# EAGLE design VCAPC_panel (EAGLE 6.5.0)
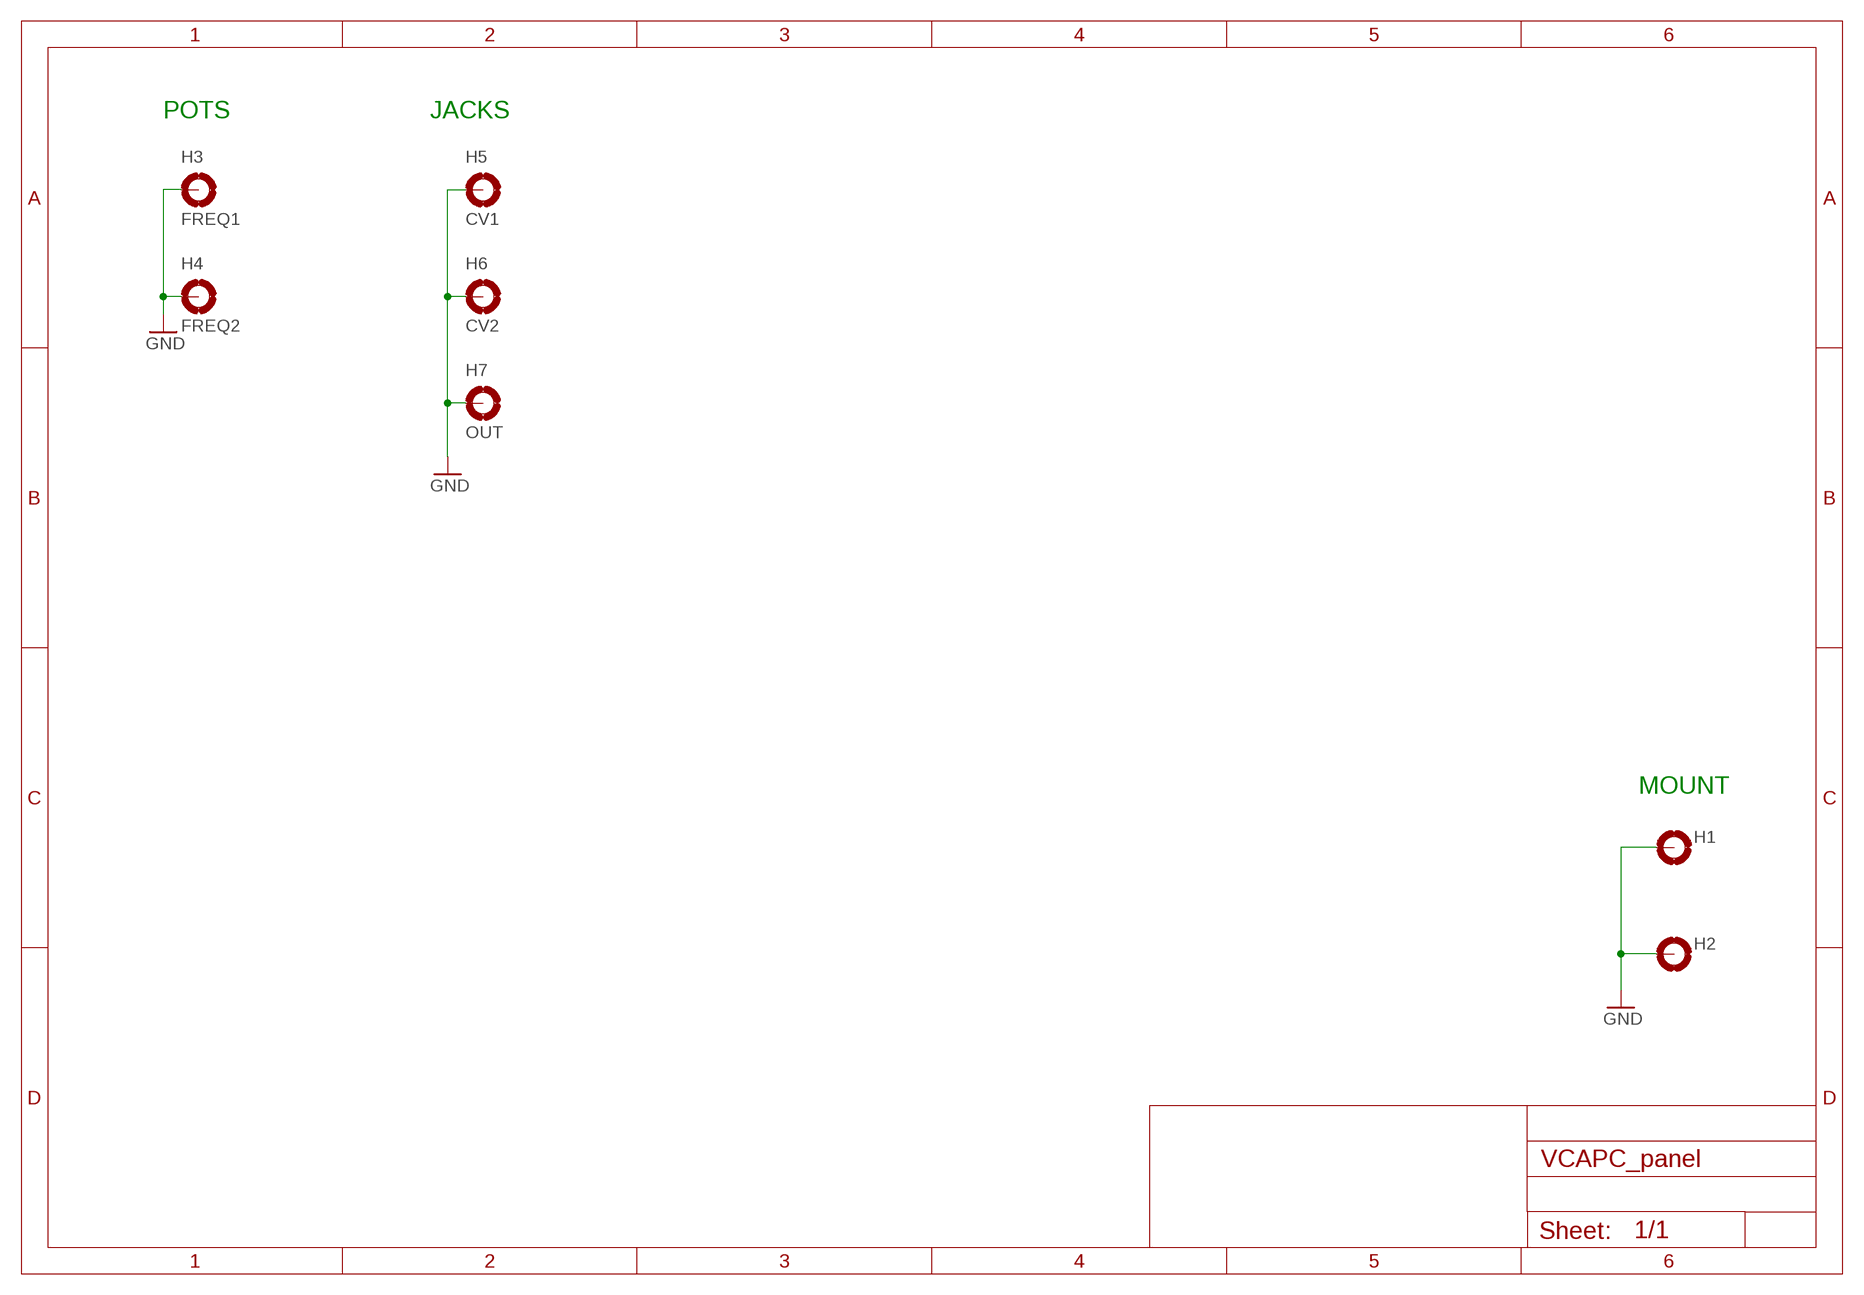
[diagram p0: schematic, sheet 1]

## Parts
H1  MOUNT-PAD-LONG3.2  [3,2-PAD_L]
H2  MOUNT-PAD-LONG3.2  [3,2-PAD_L]
H3  FREQ1  MOUNT-PAD-ROUNDPOT1  [POT_WITH_SCALE]
H4  FREQ2  MOUNT-PAD-ROUNDPOT1  [POT_WITH_SCALE]
H5  CV1  MOUNT-PAD-ROUNDJACK  [PAD_JACK]
H6  CV2  MOUNT-PAD-ROUNDJACK  [PAD_JACK]
H7  OUT  MOUNT-PAD-ROUNDJACK  [PAD_JACK]

## Nets
GND: H1.B3,2(MOUNT) H2.B3,2(MOUNT) H3.1(MOUNT) H4.1(MOUNT) H5.B6,223(MOUNT) H6.B6,223(MOUNT) H7.B6,223(MOUNT)

## Notes on the sheet
- POTS | JACKS
- MOUNT

## Library data of the parts
H1 H2 = _motovilo_holes:MOUNT-PAD-LONG: MOUNT PAD, long
H3-H7 = _motovilo_holes:MOUNT-PAD-ROUND: MOUNT PAD, round

## Board
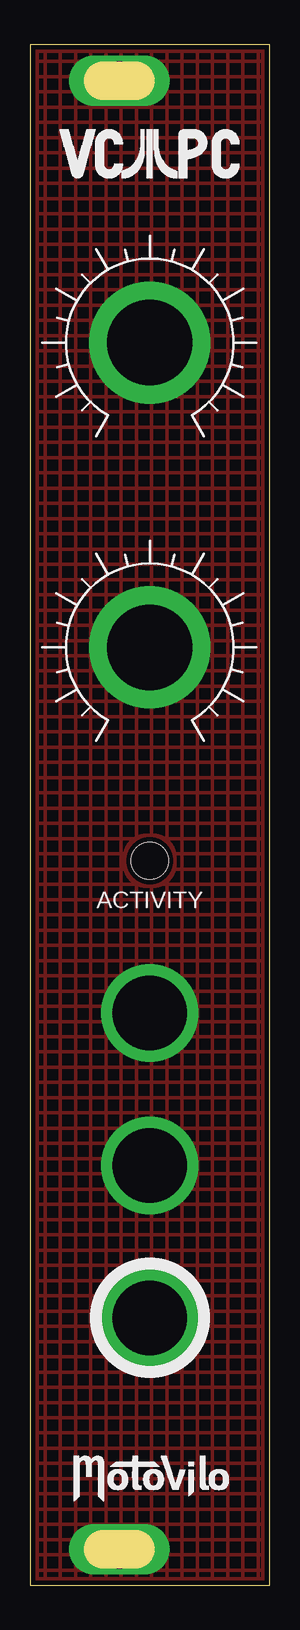
[diagram p1: board, top side]
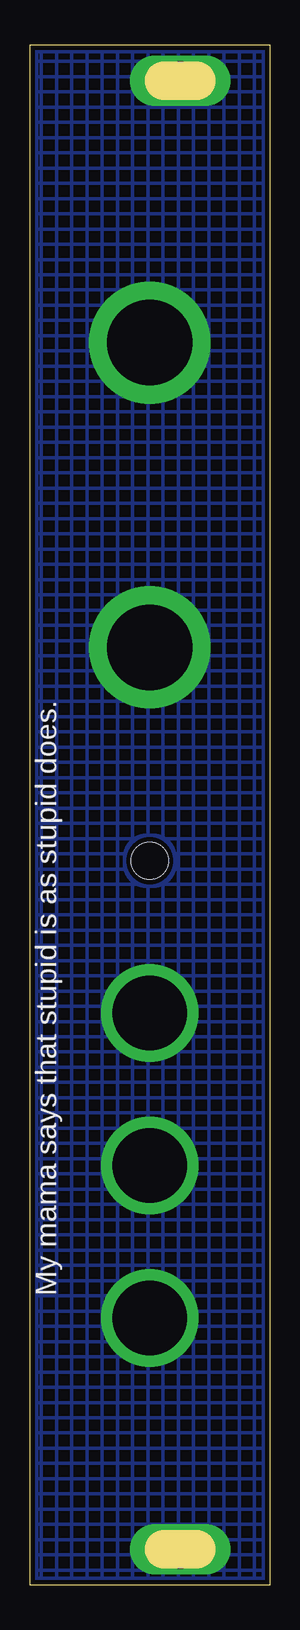
[diagram p2: board, bottom side, seen from below]

Size 20 x 128.4 mm. Coordinates in mm from the lower left corner, seen from the top.
Outline: 0,0 20,0 20,128.4 0,128.4 0,0
Copper layers (1*16): Top 0.035mm / dielectric 1.5mm / Bottom 0.035mm
Design rules "Motovilo Design Rules #2 (8mil)": minimum track width 10mil, minimum drill 12mil, track to track 8mil, track to pad 8mil, pad to pad 8mil, via to via 8mil, smd to smd 0mil, copper to edge 16mil, drill to drill 25mil, minimum pad ring 10mil, minimum via ring 6mil, stop-mask expansion 2mil, vias tented up to drill 100mil, thermal gap 10mil
Holes 3.1 mm at 10,60.39

### Footprints (pad centres in the part's own frame; a part is rotated, then mirrored left to right if it is on the bottom)
3,2-PAD_L = drill 3.2 pad 3.81 long: B3,2 0,0
POT_WITH_SCALE = drill 7.112 pad 10.16: 1 0,0
PAD_JACK = drill 6.223 pad 8.128: B6,223 0,0

### Placement (x,y rotation side)
H1  7.45,3 0 top
H2  7.45,125.4 0 top
H3  10,103.57 0 top
H4  10,78.17 0 top
H5  10,47.69 0 top
H6  10,34.99 0 top
H7  10,22.29 0 top
U$2  [VCAPC]  2.5,117.27 0 top
U$3  [LOGO_SPACE_002A]  3.63,7 0 top

### Tracks (layer width: path | path; a pad name or v marks a point on that pad's centre or on a via)
GND
  pour Top (isolate 0.406, no thermals, hatched): 0,0 0,128.4 20,128.4 20,0
  pour Bottom (isolate 0.406, no thermals, hatched): 0,0 0,128.4 20,128.4 20,0

### Text on the board
tPlace: ACTIVITY
bPlace: My mama says that stupid is as stupid does.